# Altium project Receptor 32.PrjPcb
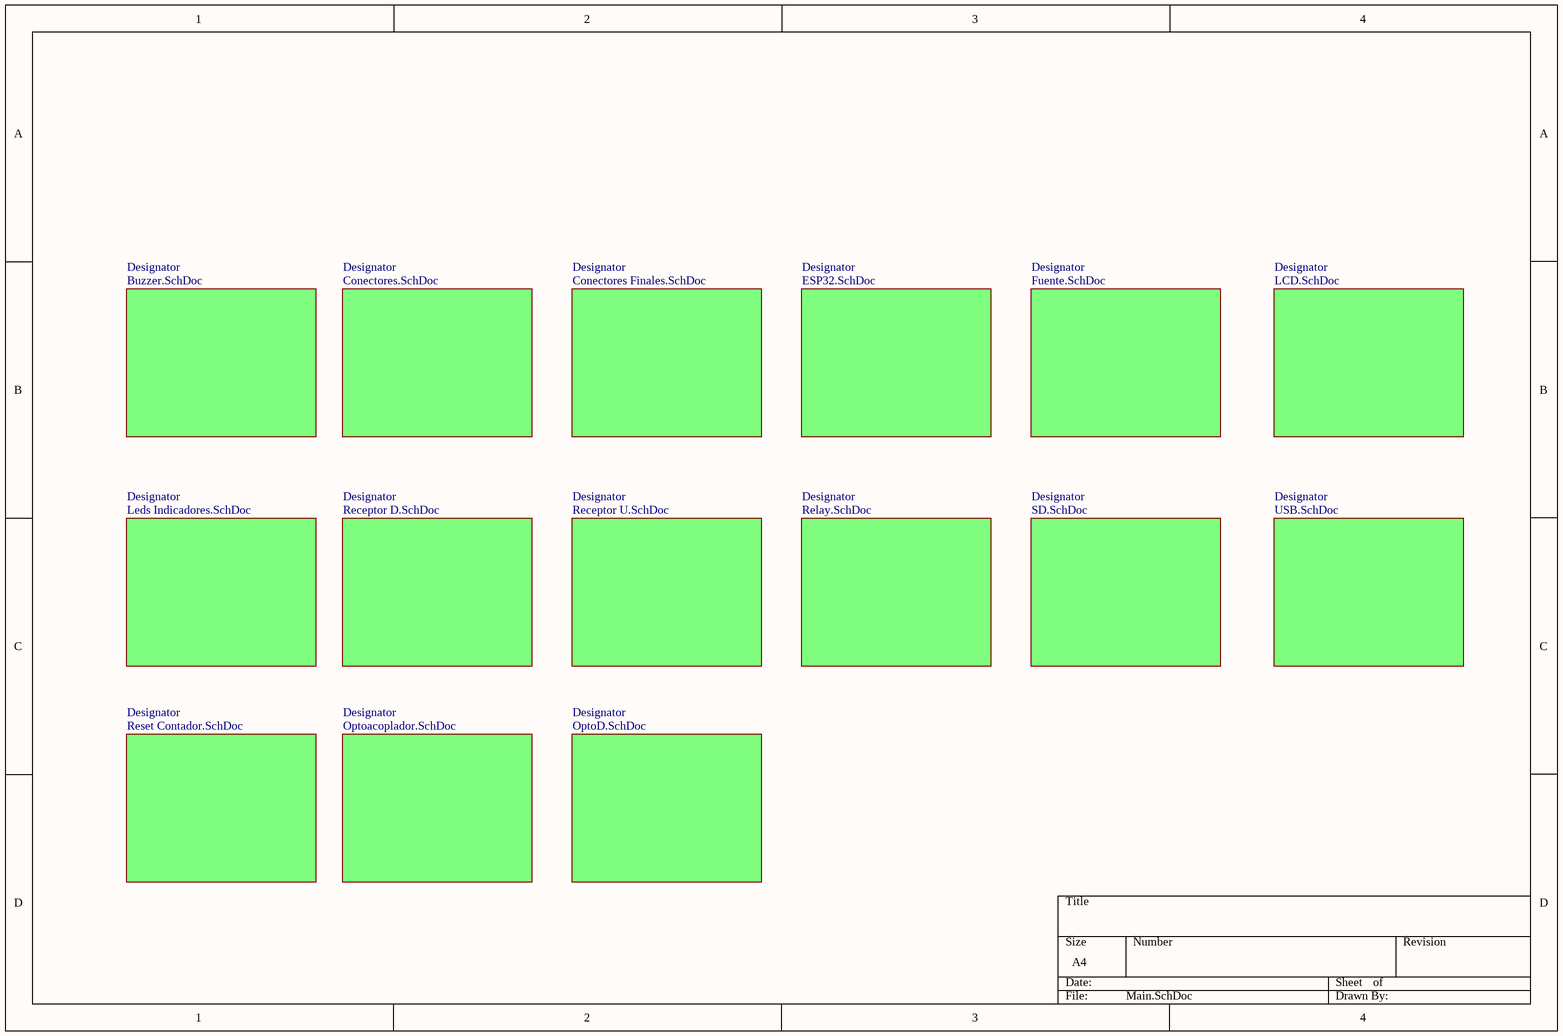
[diagram p0: Main.SchDoc]
16 sheets, 139 parts. Net scope: global (net labels, ports and power ports of the same name join across sheets).
Board files: Receptor32DV1.0.PcbDoc, Receptor32UV1.0.PcbDoc
Sheets:
  Main.SchDoc
    Designator = Buzzer.SchDoc
    Designator = Conectores.SchDoc
    Designator = Conectores Finales.SchDoc
    Designator = ESP32.SchDoc
    Designator = Fuente.SchDoc
    Designator = LCD.SchDoc
    Designator = Leds Indicadores.SchDoc
    Designator = Receptor D.SchDoc
    Designator = Receptor U.SchDoc
    Designator = Relay.SchDoc
    Designator = SD.SchDoc
    Designator = USB.SchDoc
    Designator = Reset Contador.SchDoc
    Designator = Optoacoplador.SchDoc
    Designator = OptoD.SchDoc

## Sheet Main.SchDoc
size A4

### Sub-sheets
Designator = Buzzer.SchDoc: no entries
Designator = Conectores.SchDoc: no entries
Designator = Conectores Finales.SchDoc: no entries
Designator = ESP32.SchDoc: no entries
Designator = Fuente.SchDoc: no entries
Designator = LCD.SchDoc: no entries
Designator = Leds Indicadores.SchDoc: no entries
Designator = Receptor D.SchDoc: no entries
Designator = Receptor U.SchDoc: no entries
Designator = Relay.SchDoc: no entries
Designator = SD.SchDoc: no entries
Designator = USB.SchDoc: no entries
Designator = Reset Contador.SchDoc: no entries
Designator = Optoacoplador.SchDoc: no entries
Designator = OptoD.SchDoc: no entries

## Sheet Buzzer.SchDoc
size A4
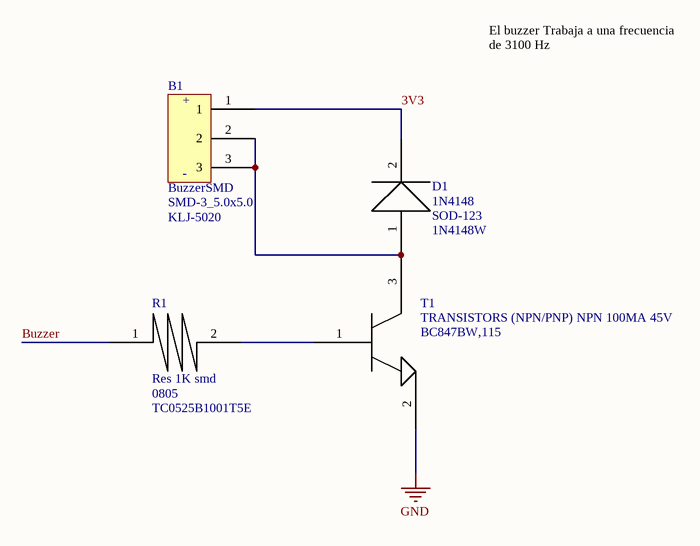
[diagram p1: Buzzer.SchDoc]

### Parts
B1  BuzzerSMD  Package: SMD-3_5.0x5.0  MFR.Part #: KLJ-5020  [BUZZERSMD]
D1  1N4148  Package: SOD-123  MFR.Part #: 1N4148W  [1N4148]
R1  Res 1K smd  Package: 0805  MFR.Part #: TC0525B1001T5E  [RES 1K]
T1  TRANSISTORS (NPN/PNP) NPN 100MA 45V  Supplier Number Part: BC847BW,115  [C8659]

### Nets
GND: T1.2
3V3: B1.1 D1.2
Buzzer: R1.1
NetB1_2: B1.2 B1.3 D1.1 T1.3
NetR1_2: R1.2 T1.1

### Notes on the sheet
- El buzzer Trabaja a una frecuencia de 3100 Hz
- (in symbol BuzzerSMD) +; -

### Library data of the parts
T1 = C8659: TRANSISTORS (NPN/PNP) NPN 100MA 45V SOT-323(SC-70) ROHS; Package Part: SOT-323-3

## Sheet Conectores.SchDoc
size A4
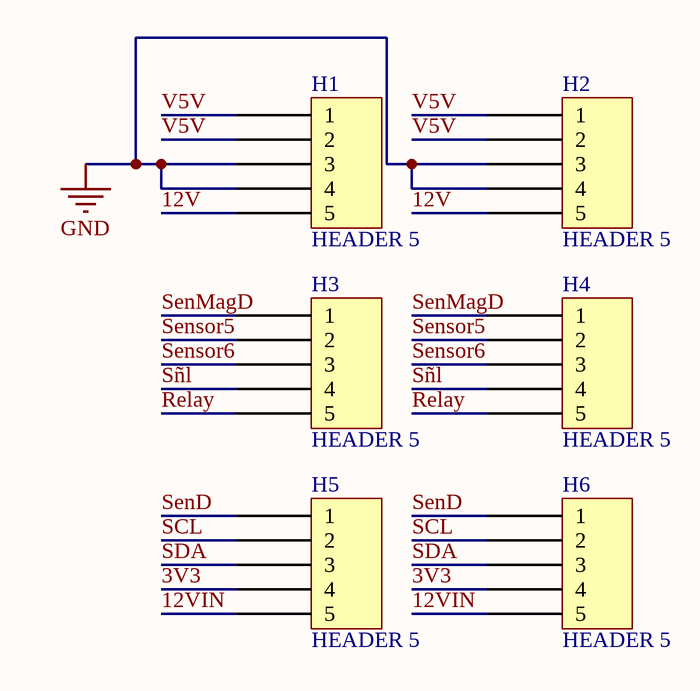
[diagram p2: Conectores.SchDoc]

### Parts
H1  HEADER 5  [HEADER5]
H2  HEADER 5  [HEADER5]
H3  HEADER 5  [HEADER5]
H4  HEADER 5  [HEADER5]
H5  HEADER 5  [HEADER5]
H6  HEADER 5  [HEADER5]

### Nets
GND: H1.3 H1.4 H2.3 H2.4
3V3: H5.4 H6.4
12V: H1.5 H2.5
12VIN: H5.5 H6.5
Relay: H3.5 H4.5
SCL: H5.2 H6.2
SDA: H5.3 H6.3
SenD: H5.1 H6.1
SenMagD: H3.1 H4.1
Sensor5: H3.2 H4.2
Sensor6: H3.3 H4.3
Sñl: H3.4 H4.4
V5V: H1.1 H1.2 H2.1 H2.2

## Sheet Conectores Finales.SchDoc
size A4
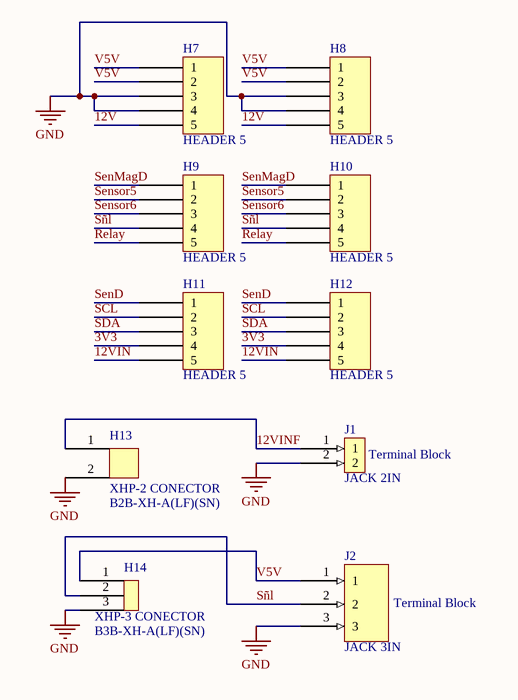
[diagram p3: Conectores Finales.SchDoc]

### Parts
H7  HEADER 5  [HEADER5]
H8  HEADER 5  [HEADER5]
H9  HEADER 5  [HEADER5]
H10  HEADER 5  [HEADER5]
H11  HEADER 5  [HEADER5]
H12  HEADER 5  [HEADER5]
H13  XHP-2 CONECTOR  [CONECTOR 2 PINES]
H14  XHP-3 CONECTOR  [CONECTOR XHP-3]
J1  JACK 2IN  [Terminal Blocks 2in]
J2  JACK 3IN  [Terminal Blocks 3in]

### Nets
GND: H7.3 H7.4 H8.3 H8.4 H13.2 H14.3 J1.2 J2.3
3V3: H11.4 H12.4
12V: H7.5 H8.5
12VIN: H11.5 H12.5
12VINF: H13.1 J1.1
Relay: H9.5 H10.5
SCL: H11.2 H12.2
SDA: H11.3 H12.3
SenD: H11.1 H12.1
SenMagD: H9.1 H10.1
Sensor5: H9.2 H10.2
Sensor6: H9.3 H10.3
Sñl: H9.4 H10.4 H14.2 J2.2
V5V: H7.1 H7.2 H8.1 H8.2 H14.1 J2.1

### Notes on the sheet
- (in symbol JACK 2IN) Terminal Block
- (in symbol JACK 3IN) Terminal Block

### Library data of the parts
H13 = B2B-XH-A(LF)(SN): CONECTOR JST-XH 2 PINES; SUPPLIER NUMBER PART: B2B-XH-A(LF)(SN)
H14 = B3B-XH-A(LF)(SN): CONECTOR JST-XH 3 PINES; SUPPLIER NUMBER PART: B3B-XH-A(LF)(SN)
J1 = JACK 2IN: Pluggable Terminal Blocks WR-TBL Mod312 5.08mm 2Pin Opn Hztl PCBHdr; Manufacturer: Wurth Electronics; Manufacturer Part Number: 691312510002; Current Rating: 20 A; Mounting Angle: Horizontal; Mounting Method: PCB; Number of Positions: 2 Position; Voltage Rating: 300 V; Supplier 1: Mouser; RoHS: RoHS Compliant; Category: Pluggable Terminal Blocks; Stock 1: 413; Pricing 1: 1=0.528, 10=0.499, 50=0.475, 100=0.453, 500=0.429, 1000=0.416 (AUD); Color: Green; Connection Method: -; Contact Plating: Tin; Housing Material: Polybutylene Terephthalate (PBT); Packaging: Bulk; Product: Headers; Series: WR-TBL; Termination Style: Through Hole; Brand: Wurth Electronics; Contact Material: Brass; Flammability Rating: UL 94 V-0; Pitch: 5.08 mm; Wire Gauge Range: -; Wire Orientation: Horizontal; RoHS - Mouser: Y; Minimum Order Quantity: 1; Reeling: False; ComponentLink1URL: http://www.mouser.com/ds/2/445/6913125100xx-537850.pdf; ComponentLink1Description: http://www.mouser.com/ds/2/445/6913125100xx-537850.pdf; Supplier Part Number 1: 710-691312510002
J2 = JACK 3IN: Pluggable Terminal Blocks WR-TBL Mod312 5.08mm 3Pin Opn Hztl PCBHdr; Manufacturer: Wurth Electronics; Manufacturer Part Number: 691312510003; Current Rating: 20 A; Mounting Angle: Horizontal; Mounting Method: PCB; Number of Positions: 3 Position; Voltage Rating: 300 V; Supplier 1: Mouser; RoHS: RoHS Compliant; Category: Pluggable Terminal Blocks; Stock 1: 425; Pricing 1: 1=0.784, 10=0.750, 50=0.714, 100=0.677, 500=0.630, 1000=0.624 (AUD); Color: Green; Connection Method: -; Contact Plating: Tin; Housing Material: Polybutylene Terephthalate (PBT); Packaging: Bulk; Product: Headers; Series: WR-TBL; Termination Style: Through Hole; Brand: Wurth Electronics; Contact Material: Brass; Flammability Rating: UL 94 V-0; Pitch: 5.08 mm; Wire Gauge Range: -; Wire Orientation: Horizontal; RoHS - Mouser: Y; Minimum Order Quantity: 1; Reeling: False; ComponentLink1URL: http://www.mouser.com/ds/2/445/6913125100xx-537850.pdf; ComponentLink1Description: http://www.mouser.com/ds/2/445/6913125100xx-537850.pdf; Supplier Part Number 1: 710-691312510003

## Sheet ESP32.SchDoc
size A4
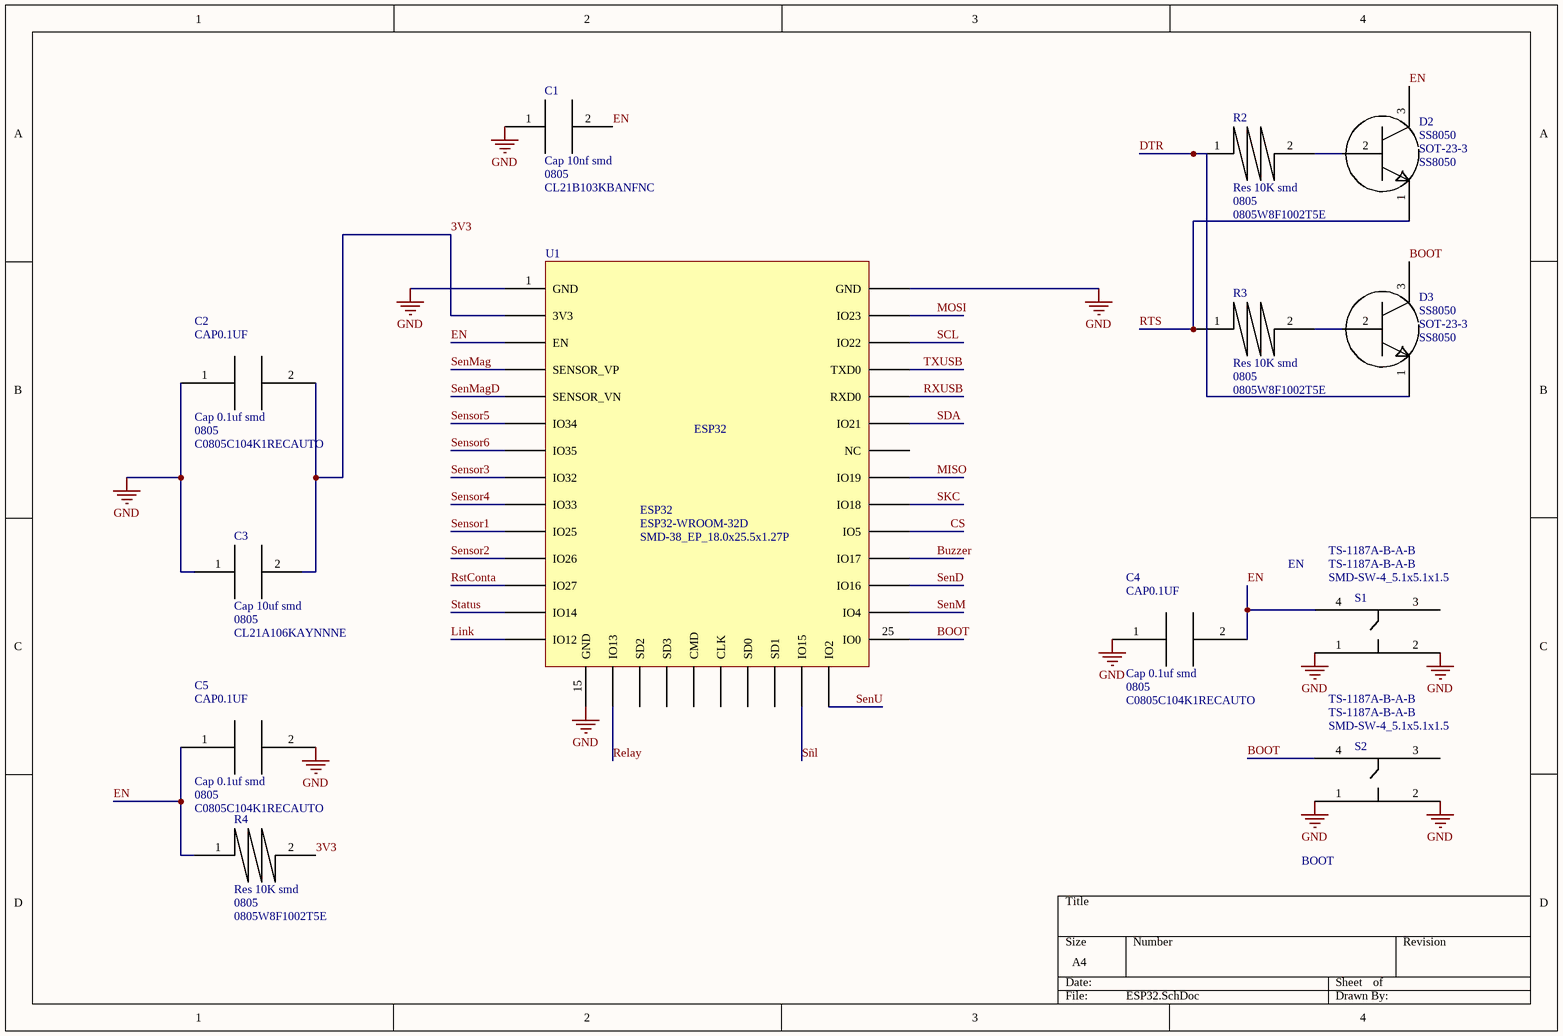
[diagram p4: ESP32.SchDoc]

### Parts
C1  Cap 10nf smd  Package: 0805  MFR.Part #: CL21B103KBANFNC  [CAP10NFSMD]
C2  Cap 0.1uf smd  Package: 0805  MFR.Part #: C0805C104K1RECAUTO  [CAP0.1UFSMD]
C3  Cap 10uf smd  Package: 0805  MFR.Part #: CL21A106KAYNNNE  [CAP10UFSMD]
C4  Cap 0.1uf smd  Package: 0805  MFR.Part #: C0805C104K1RECAUTO  [CAP0.1UFSMD]
C5  Cap 0.1uf smd  Package: 0805  MFR.Part #: C0805C104K1RECAUTO  [CAP0.1UFSMD]
D2  SS8050  Package: SOT-23-3  [SS8050]
D3  SS8050  Package: SOT-23-3  [SS8050]
R2  Res 10K smd  Package: 0805  MFR.Part #: 0805W8F1002T5E  [RES 10K]
R3  Res 10K smd  Package: 0805  MFR.Part #: 0805W8F1002T5E  [RES 10K]
R4  Res 10K smd  Package: 0805  MFR.Part #: 0805W8F1002T5E  [RES 10K]
S1  TS-1187A-B-A-B  Package: SMD-SW-4_5.1x5.1x1.5  [TS-1187A-B-A-B]
S2  TS-1187A-B-A-B  Package: SMD-SW-4_5.1x5.1x1.5  [TS-1187A-B-A-B]
U1  ESP32  Package: SMD-38_EP_18.0x25.5x1.27P  MFR.Part #: ESP32-WROOM-32D  [ESP32]

### Nets
GND: C1.1 C2.1 C3.1 C4.1 C5.2 S1.1 S1.2 S2.1 S2.2 U1.1(GND) U1.15(GND) U1.38(GND)
3V3: C2.2 C3.2 R4.2 U1.2(3V3)
BOOT: D3.3 S2.4 U1.25(IO0)
Buzzer: U1.28(IO17)
CS: U1.29(IO5)
DTR: D3.1 R2.1
EN: C1.2 C4.2 C5.1 D2.3 R4.1 S1.4 U1.3(EN)
Link: U1.14(IO12)
MISO: U1.31(IO19)
MOSI: U1.37(IO23)
Relay: U1.16(IO13)
RstConta: U1.12(IO27)
RTS: D2.1 R3.1
RXUSB: U1.34(RXD0)
SCL: U1.36(IO22)
SDA: U1.33(IO21)
SenD: U1.27(IO16)
SenM: U1.26(IO4)
SenMag: U1.4(SENSOR_VP)
SenMagD: U1.5(SENSOR_VN)
Sensor1: U1.10(IO25)
Sensor2: U1.11(IO26)
Sensor3: U1.8(IO32)
Sensor4: U1.9(IO33)
Sensor5: U1.6(IO34)
Sensor6: U1.7(IO35)
SenU: U1.24(IO2)
SKC: U1.30(IO18)
Status: U1.13(IO14)
Sñl: U1.23(IO15)
TXUSB: U1.35(TXD0)
NetD2_2: D2.2 R2.2
NetD3_2: D3.2 R3.2

Not connected (* = marked no-connect by the designer): S1 3; S2 3; U1 17(SD2) 18(SD3) 19(CMD) 20(CLK) 21(SD0) 22(SD1) 32(NC)

### Notes on the sheet
- EN
- BOOT
- (in symbol Cap 0.1uf smd) CAP0.1UF

### Library data of the parts
C1 = Cap 10nf smd: 10nf
C2 C4 C5 = Cap 0.1uf smd: 0.1uf
C3 = Cap 10uf smd: 10uf
R2-R4 = Res 10K smd: 10K
D2 D3 = SS8050: MFR.Part #: SS8050
S1 S2 = TS-1187A-B-A-B: MFR.Part #: TS-1187A-B-A-B

## Sheet Fuente.SchDoc
size A4
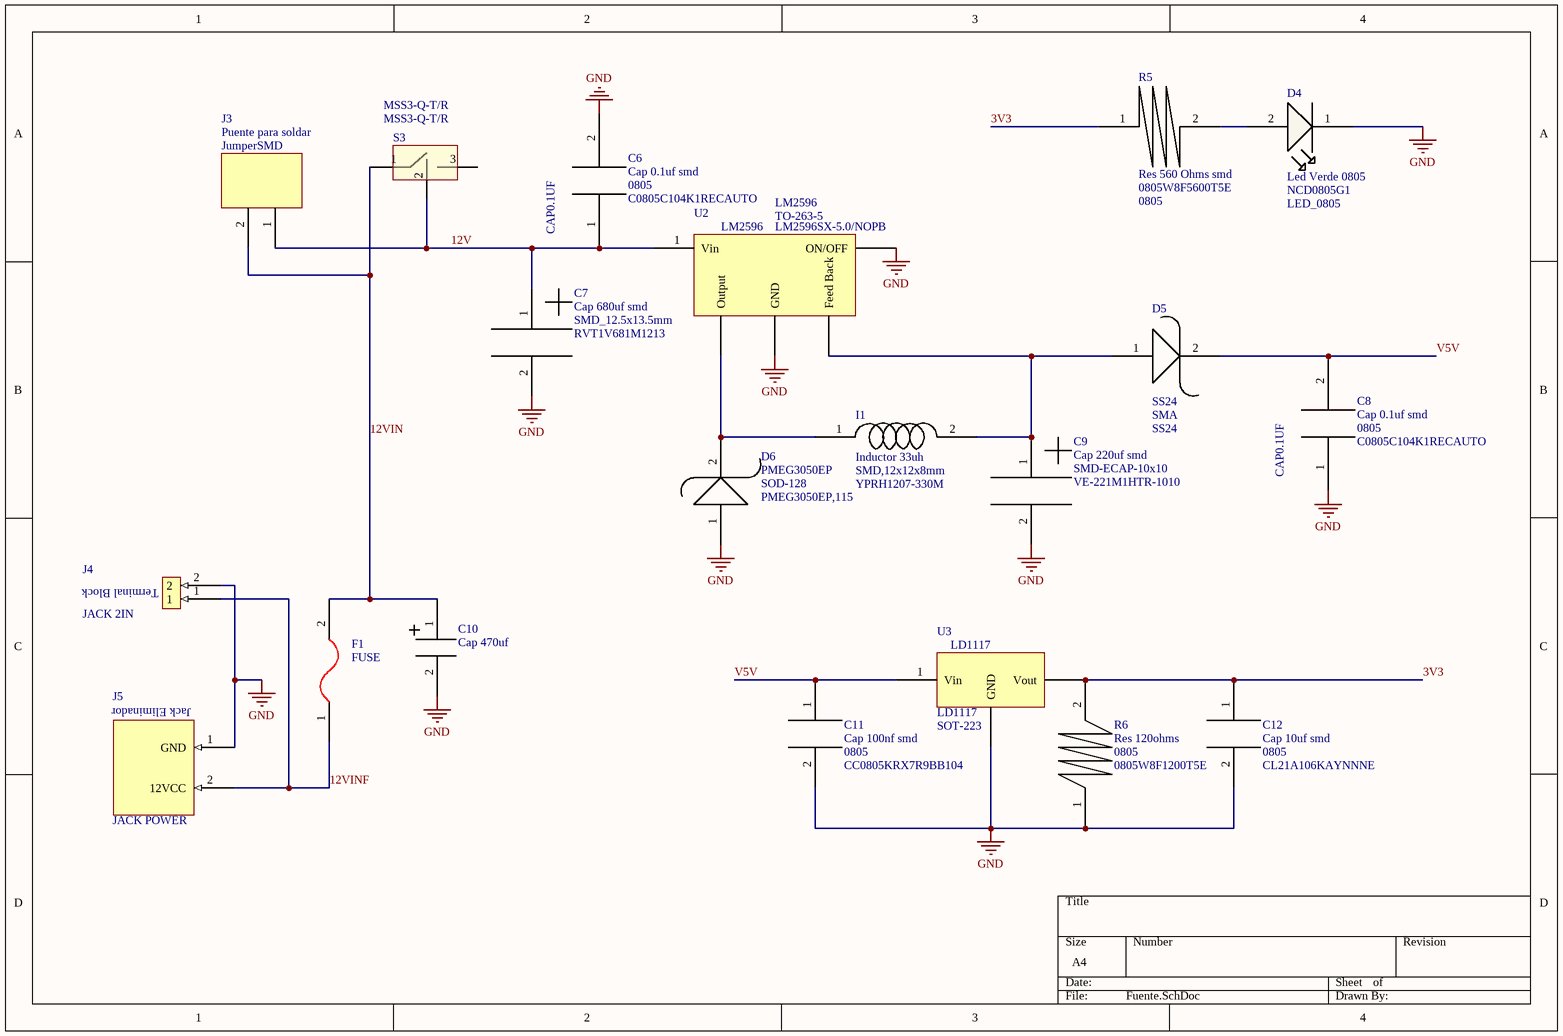
[diagram p5: Fuente.SchDoc]

### Parts
C6  Cap 0.1uf smd  Package: 0805  MFR.Part #: C0805C104K1RECAUTO  [CAP0.1UFSMD]
C7  Cap 680uf smd  Package: SMD_12.5x13.5mm  MFR.Part #: RVT1V681M1213  [CAP680UFSMD]
C8  Cap 0.1uf smd  Package: 0805  MFR.Part #: C0805C104K1RECAUTO  [CAP0.1UFSMD]
C9  Cap 220uf smd  Package: SMD-ECAP-10x10  MFR.Part #: VE-221M1HTR-1010  [CAP220UFSMD]
C10  Cap 470uf  [Cap 470uf]
C11  Cap 100nf smd  Package: 0805  MFR.Part #: CC0805KRX7R9BB104  [CAP100NFSMD]
C12  Cap 10uf smd  Package: 0805  MFR.Part #: CL21A106KAYNNNE  [CAP10UFSMD]
D4  Led Verde 0805  MFR.Part #: NCD0805G1  Package: LED_0805  [Led 0805 Verde]
D5  SS24  Package: SMA  [SS24]
D6  PMEG3050EP  Package: SOD-128  MFR.Part #: PMEG3050EP,115  [PMEG3050EP]
F1  FUSE  [FUSE]
I1  Inductor 33uh  Package: SMD,12x12x8mm  MFR.Part #: YPRH1207-330M  [Inductor 33UH]
J3  JumperSMD  [Jumper SMD]
J4  JACK 2IN  [Terminal Blocks 2in]
J5  JACK POWER  [POWER JACK]
R5  Res 560 Ohms smd  MFR.Part #: 0805W8F5600T5E  Package: 0805  [RES 560]
R6  Res 120ohms  Package: 0805  MFR.Part #: 0805W8F1200T5E  [RES 120OHMS]
S3  MSS3-Q-T/R  [MSS3-Q-T/R]
U2  LM2596  MFR.Part #: LM2596SX-5.0/NOPB  Package: TO-263-5  [LM2596]
U3  LD1117  Package: SOT-223  [LD1117]

### Nets
GND: C6.2 C7.2 C8.1 C9.2 C10.2 C11.2 C12.2 D4.1 D6.1 J4.2 J5.1(GND) J5.3(GND) R6.1 U2.3(GND) U2.5(ON/OFF) U3.2(GND)
3V3: C12.1 R5.1 R6.2 U3.3(Vout)
12V: C6.1 C7.1 J3.1 S3.2 U2.1(Vin)
12VIN: C10.1 F1.2 J3.2 S3.1
12VINF: F1.1 J4.1 J5.2(12VCC)
V5V: C8.2 C11.1 D5.2 U3.1(Vin)
NetC9_1: C9.1 D5.1 I1.2 U2.4(Feed_Back)
NetD4_2: D4.2 R5.2
NetD6_2: D6.2 I1.1 U2.2(Output)

Not connected (* = marked no-connect by the designer): S3 3

### Notes on the sheet
- (in symbol Cap 0.1uf smd) CAP0.1UF
- (in symbol JACK 2IN) Terminal Block
- (in symbol JACK 12V) Jack Eliminador
- (in symbol Jumper para soldar) Puente para soldar

### Library data of the parts
C6 C8 = Cap 0.1uf smd: 0.1uf
C7 = Cap 680uf smd: Cap 680uf
C9 = Cap 220uf smd: Cap 220uf
C10 = Cap 470uf: RVT1V471M1010; MFR.Part #: RVT1V471M1010; Package: SMD-ECAP-10x10
C11 = Cap 100nf smd: 100nf
C12 = Cap 10uf smd: 10uf
D4 = Led 0805 Verde
D5 = SS24: Schottky 40V 2A; MFR.Part #: SS24
D6 = PMEG3050EP: Diodo Schottky 30V 5A
F1 = FUSE HOLDER
I1 = Inductor 33uh: 33uh
J3 = Jumper para soldar
J4 = JACK 2IN: as J1 on sheet Conectores Finales; Supplier 1: Mouser; RoHS: RoHS Compliant; Category: Pluggable Terminal Blocks; Stock 1: 413; Pricing 1: 1=0.528, 10=0.499, 50=0.475, 100=0.453, 500=0.429, 1000=0.416 (AUD); Color: Green; Connection Method: -; Contact Plating: Tin; Housing Material: Polybutylene Terephthalate (PBT); Packaging: Bulk; Product: Headers; Series: WR-TBL; Termination Style: Through Hole; Brand: Wurth Electronics; Contact Material: Brass; Flammability Rating: UL 94 V-0; Pitch: 5.08 mm; Wire Gauge Range: -; Wire Orientation: Horizontal; RoHS - Mouser: Y; Minimum Order Quantity: 1; Reeling: False; ComponentLink1URL: http://www.mouser.com/ds/2/445/6913125100xx-537850.pdf; ComponentLink1Description: http://www.mouser.com/ds/2/445/6913125100xx-537850.pdf; Supplier Part Number 1: 710-691312510002
J5 = JACK 12V: DC Power Connectors R/A POWER JACK; Manufacturer: Switchcraft; Manufacturer Part Number: RAPC712X; Connector Type: DC Power Jack; Current Rating: 5 A; Inside Contact Diameter: 2.5 mm; Mounting Angle: Right; Insulation Resistance: 30 MOhms; Supplier 1: Mouser; RoHS: RoHS Compliant; Category: DC Power Connectors; Stock 1: 23988; Pricing 1: 1=1.52, 10=1.49, 25=1.44, 50=1.35, 100=1.26, 200=1.25, 500=1.19, 1000=1.10, 2000=1.06 (AUD); Color: Black; Contact Plating: Nickel; Housing Material: Thermoplastic; Packaging: Bulk; Product: Jacks; Series: RAPC; Termination Style: Through Hole; Brand: Switchcraft; Contact Material: Brass; Flammability Rating: UL 94 V-0; Contact Gender: Female; Product Category: DC Jacks; Standard Pack Qty: 2500; RoHS - Mouser: Y; Minimum Order Quantity: 1; Reeling: False; ComponentLink1URL: http://www.mouser.com/ds/2/393/rapc712x_cd-371318.pdf; ComponentLink1Description: http://www.mouser.com/ds/2/393/rapc712x_cd-371318.pdf; Supplier Part Number 1: 502-RAPC712X
R6 = Res 120ohms: 120 ohms
S3 = MSS3-Q-T/R: Package: SW-SMD; MFR.Part #: MSS3-Q-T/R

## Sheet LCD.SchDoc
size A4
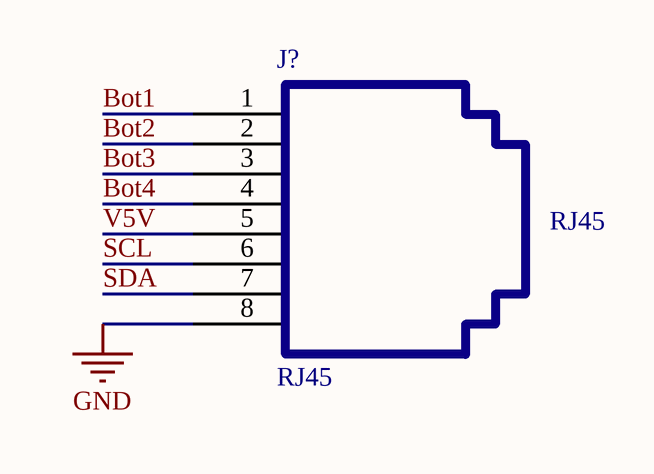
[diagram p6: LCD.SchDoc]

### Parts
J?  RJ45  [RJ45 PLUG]

### Nets
GND: J?.8 J?.9
Bot1: J?.1
Bot2: J?.2
Bot3: J?.3
Bot4: J?.4
SCL: J?.6
SDA: J?.7
V5V: J?.5

### Library data of the parts
J? = RJ45: Modular Connectors / Ethernet Connectors 8 PCB TOP ENTRY; Manufacturer: TE Connectivity / AMP; Manufacturer Part Number: 5556416-1; Mounting Angle: Vertical; Number of Positions: 8 Position; Shielding: Unshielded; Number of Ports: 1; Performance Category: Cat 3; Supplier 1: Mouser; RoHS: RoHS Compliant; Category: Modular Connectors / Ethernet Connectors; Stock 1: 28811; Pricing 1: 1=1.89, 25=1.79, 50=1.71, 100=1.63, 200=1.48, 500=1.33, 1000=1.18, 2000=1.07, 5000=1.04 (AUD); Color: Black; Contact Plating: Gold; Housing Material: Polybutylene Terephthalate (PBT); Packaging: Tray; Series: 555; Termination Style: Through Hole; Brand: TE Connectivity / AMP; Contact Material: Phosphor Bronze; Flammability Rating: UL 94 V-0; Product Category: Modular Jacks; Standard Pack Qty: 152; USOC Codes: RJ45; RoHS - Mouser: Y; Minimum Order Quantity: 1; Reeling: False; ComponentLink1URL: http://www.mouser.com/ds/2/418/NG_CD_5556416_C1-628847.pdf; ComponentLink1Description: http://www.mouser.com/ds/2/418/NG_CD_5556416_C1-628847.pdf; Supplier Part Number 1: 571-5556416-1

## Sheet Leds Indicadores.SchDoc
size A4
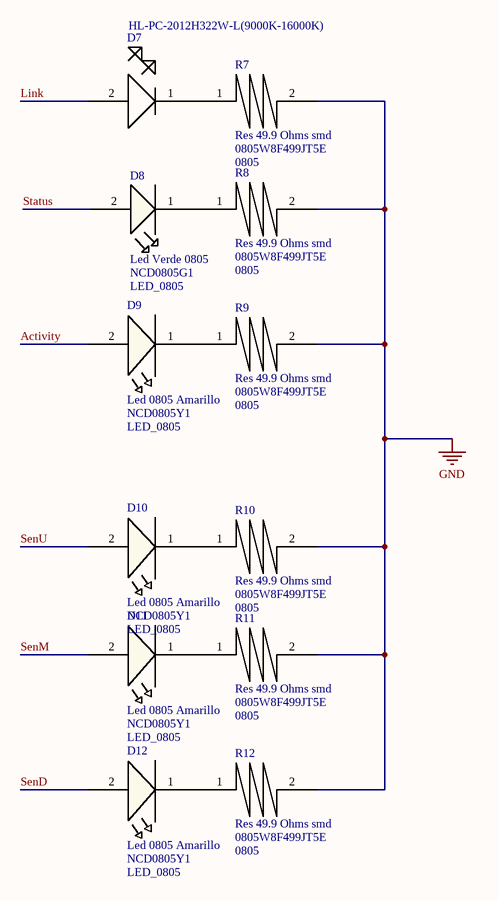
[diagram p7: Leds Indicadores.SchDoc]

### Parts
D7  HL-PC-2012H322W-L(9000K-16000K)  [Led 0805 White]
D8  Led Verde 0805  MFR.Part #: NCD0805G1  Package: LED_0805  [Led 0805 Verde]
D9  Led 0805 Amarillo  Package: LED_0805  [Led 0805 Amarillo]
D10  Led 0805 Amarillo  Package: LED_0805  [Led 0805 Amarillo]
D11  Led 0805 Amarillo  Package: LED_0805  [Led 0805 Amarillo]
D12  Led 0805 Amarillo  Package: LED_0805  [Led 0805 Amarillo]
R7  Res 49.9 Ohms smd  MFR.Part #: 0805W8F499JT5E  Package: 0805  [RES 49.9 OHMS]
R8  Res 49.9 Ohms smd  MFR.Part #: 0805W8F499JT5E  Package: 0805  [RES 49.9 OHMS]
R9  Res 49.9 Ohms smd  MFR.Part #: 0805W8F499JT5E  Package: 0805  [RES 49.9 OHMS]
R10  Res 49.9 Ohms smd  MFR.Part #: 0805W8F499JT5E  Package: 0805  [RES 49.9 OHMS]
R11  Res 49.9 Ohms smd  MFR.Part #: 0805W8F499JT5E  Package: 0805  [RES 49.9 OHMS]
R12  Res 49.9 Ohms smd  MFR.Part #: 0805W8F499JT5E  Package: 0805  [RES 49.9 OHMS]

### Nets
GND: R7.2 R8.2 R9.2 R10.2 R11.2 R12.2
Activity: D9.2
Link: D7.2
SenD: D12.2
SenM: D11.2
SenU: D10.2
Status: D8.2
NetD7_1: D7.1 R7.1
NetD8_1: D8.1 R8.1
NetD9_1: D9.1 R9.1
NetD10_1: D10.1 R10.1
NetD11_1: D11.1 R11.1
NetD12_1: D12.1 R12.1

### Library data of the parts
D7 = LED White 0805: MFR.Part #: HL-PC-2012H322W-L(9000K-16000K); Package: LED0805-RD
D8 = Led 0805 Verde
D9-D12 = Led 0805 Amarillo: NCD0805Y1; MFR.Part #: NCD0805Y1

## Sheet Receptor D.SchDoc
size A4
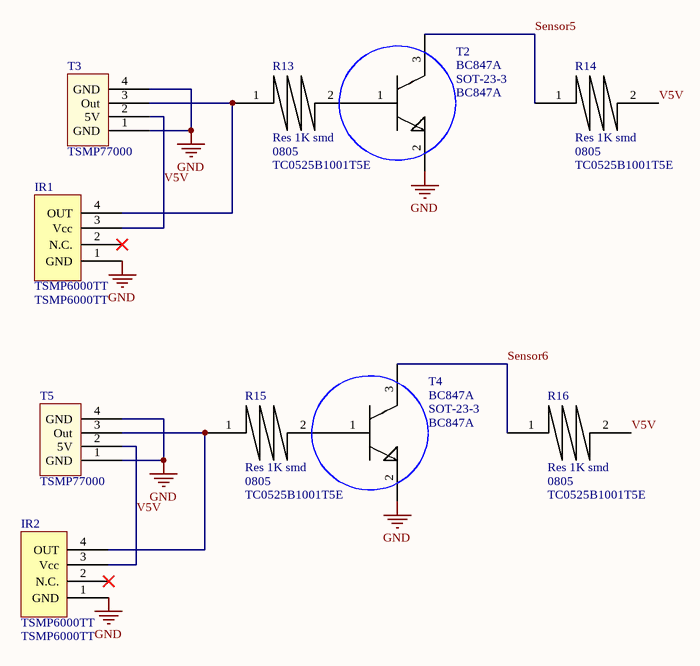
[diagram p8: Receptor D.SchDoc]

### Parts
IR1  TSMP6000TT  [TSMP6000TT]
IR2  TSMP6000TT  [TSMP6000TT]
R13  Res 1K smd  Package: 0805  MFR.Part #: TC0525B1001T5E  [RES 1K]
R14  Res 1K smd  Package: 0805  MFR.Part #: TC0525B1001T5E  [RES 1K]
R15  Res 1K smd  Package: 0805  MFR.Part #: TC0525B1001T5E  [RES 1K]
R16  Res 1K smd  Package: 0805  MFR.Part #: TC0525B1001T5E  [RES 1K]
T2  BC847A  Package: SOT-23-3  [BC847A]
T3  TSMP77000  [TSMP77000]
T4  BC847A  Package: SOT-23-3  [BC847A]
T5  TSMP77000  [TSMP77000]

### Nets
GND: IR1.1(GND) IR2.1(GND) T2.2 T3.1(GND) T3.4(GND) T4.2 T5.1(GND) T5.4(GND)
Sensor5: R14.1 T2.3
Sensor6: R16.1 T4.3
V5V: IR1.3(Vcc) IR2.3(Vcc) R14.2 R16.2 T3.2(5V) T5.2(5V)
NetIR1_4: IR1.4(OUT) R13.1 T3.3(Out)
NetIR2_4: IR2.4(OUT) R15.1 T5.3(Out)
NetR13_2: R13.2 T2.1
NetR15_2: R15.2 T4.1

Not connected (* = marked no-connect by the designer): IR1 2(N.C.)*; IR2 2(N.C.)*

### Library data of the parts
IR1 IR2 = TSMP6000TT: Mouser: https://www.mouser.mx/ProductDetail/Vishay-Semiconductors/TSMP6000TT?qs=N%2FGwOzoYEAATz68ZRXkk4Q%3D%3D; DGK: https://www.digikey.com.mx/es/products/detail/vishay-semiconductor-opto-division/TSMP6000TT/4696166; Part: TSMP6000TT
T2 T4 = BC847A: MFR.Part #: BC847A
T3 T5 = TSMP77000: # Parte: TSMP77000; Link: https://www.mouser.mx/datasheet/2/427/VISH_S_A0012397601_1-2572564.pdf

## Sheet Receptor U.SchDoc
size A4
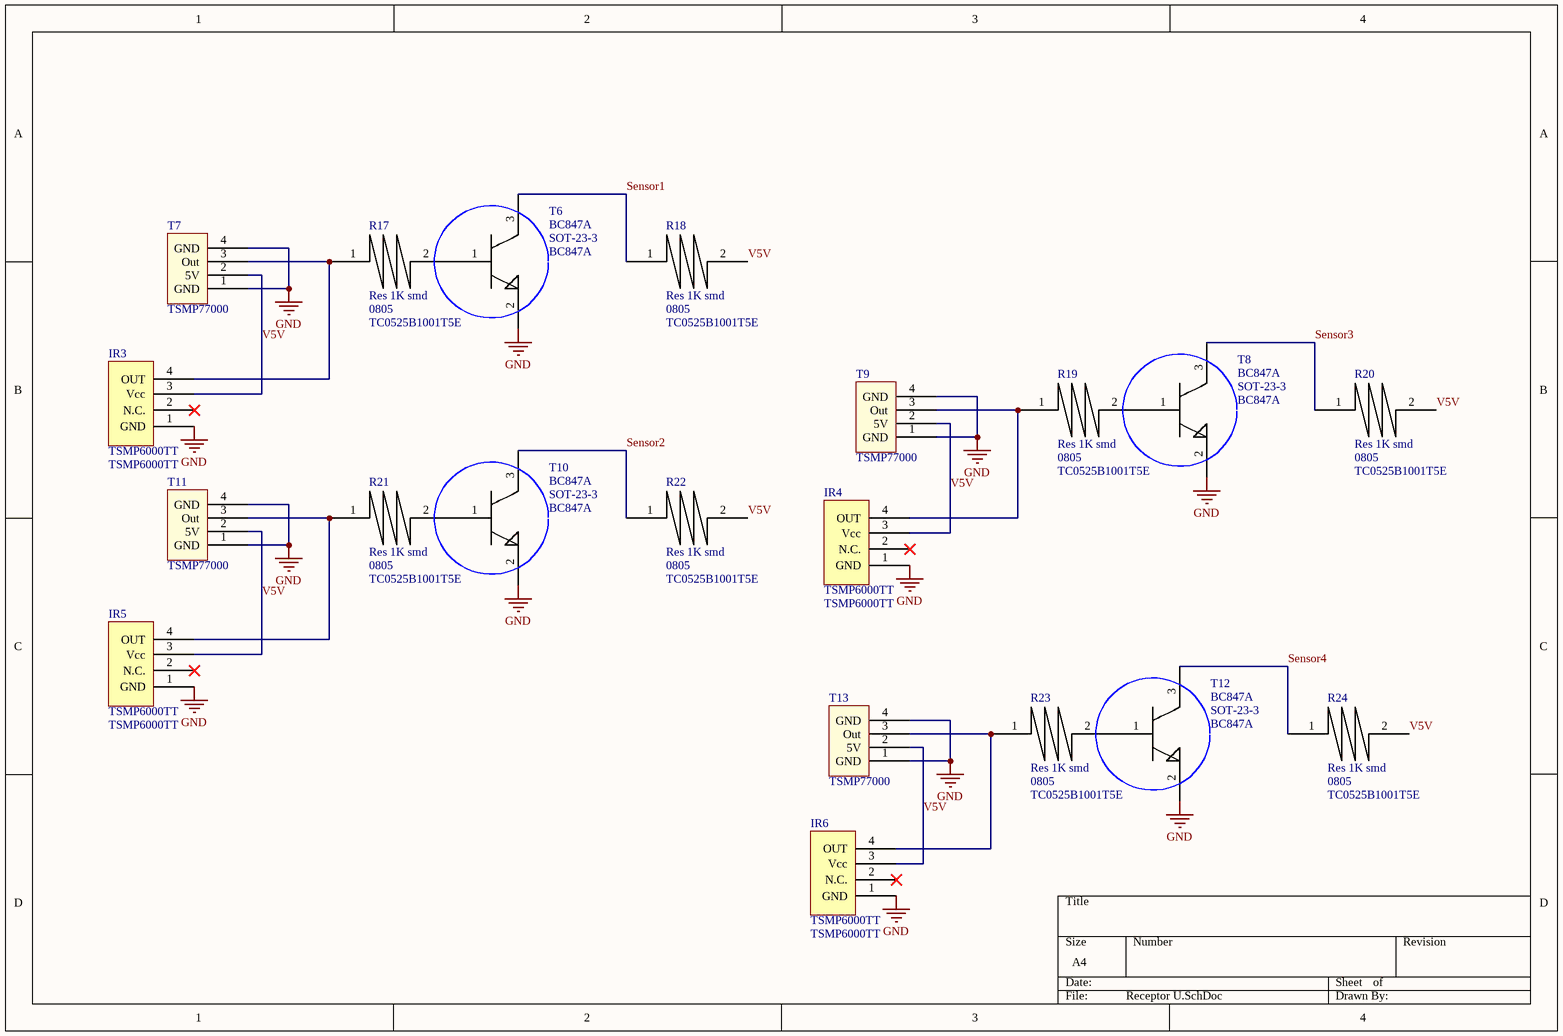
[diagram p9: Receptor U.SchDoc]

### Parts
IR3  TSMP6000TT  [TSMP6000TT]
IR4  TSMP6000TT  [TSMP6000TT]
IR5  TSMP6000TT  [TSMP6000TT]
IR6  TSMP6000TT  [TSMP6000TT]
R17  Res 1K smd  Package: 0805  MFR.Part #: TC0525B1001T5E  [RES 1K]
R18  Res 1K smd  Package: 0805  MFR.Part #: TC0525B1001T5E  [RES 1K]
R19  Res 1K smd  Package: 0805  MFR.Part #: TC0525B1001T5E  [RES 1K]
R20  Res 1K smd  Package: 0805  MFR.Part #: TC0525B1001T5E  [RES 1K]
R21  Res 1K smd  Package: 0805  MFR.Part #: TC0525B1001T5E  [RES 1K]
R22  Res 1K smd  Package: 0805  MFR.Part #: TC0525B1001T5E  [RES 1K]
R23  Res 1K smd  Package: 0805  MFR.Part #: TC0525B1001T5E  [RES 1K]
R24  Res 1K smd  Package: 0805  MFR.Part #: TC0525B1001T5E  [RES 1K]
T6  BC847A  Package: SOT-23-3  [BC847A]
T7  TSMP77000  [TSMP77000]
T8  BC847A  Package: SOT-23-3  [BC847A]
T9  TSMP77000  [TSMP77000]
T10  BC847A  Package: SOT-23-3  [BC847A]
T11  TSMP77000  [TSMP77000]
T12  BC847A  Package: SOT-23-3  [BC847A]
T13  TSMP77000  [TSMP77000]

### Nets
GND: IR3.1(GND) IR4.1(GND) IR5.1(GND) IR6.1(GND) T6.2 T7.1(GND) T7.4(GND) T8.2 T9.1(GND) T9.4(GND) T10.2 T11.1(GND) T11.4(GND) T12.2 T13.1(GND) T13.4(GND)
Sensor1: R18.1 T6.3
Sensor2: R22.1 T10.3
Sensor3: R20.1 T8.3
Sensor4: R24.1 T12.3
V5V: IR3.3(Vcc) IR4.3(Vcc) IR5.3(Vcc) IR6.3(Vcc) R18.2 R20.2 R22.2 R24.2 T7.2(5V) T9.2(5V) T11.2(5V) T13.2(5V)
NetIR3_4: IR3.4(OUT) R17.1 T7.3(Out)
NetIR4_4: IR4.4(OUT) R19.1 T9.3(Out)
NetIR5_4: IR5.4(OUT) R21.1 T11.3(Out)
NetIR6_4: IR6.4(OUT) R23.1 T13.3(Out)
NetR17_2: R17.2 T6.1
NetR19_2: R19.2 T8.1
NetR21_2: R21.2 T10.1
NetR23_2: R23.2 T12.1

Not connected (* = marked no-connect by the designer): IR3 2(N.C.)*; IR4 2(N.C.)*; IR5 2(N.C.)*; IR6 2(N.C.)*

### Library data of the parts
IR3-IR6 = TSMP6000TT: Mouser: https://www.mouser.mx/ProductDetail/Vishay-Semiconductors/TSMP6000TT?qs=N%2FGwOzoYEAATz68ZRXkk4Q%3D%3D; DGK: https://www.digikey.com.mx/es/products/detail/vishay-semiconductor-opto-division/TSMP6000TT/4696166; Part: TSMP6000TT
T6 T8 T10 T12 = BC847A: MFR.Part #: BC847A
T7 T9 T11 T13 = TSMP77000: # Parte: TSMP77000; Link: https://www.mouser.mx/datasheet/2/427/VISH_S_A0012397601_1-2572564.pdf

## Sheet Relay.SchDoc
size A4
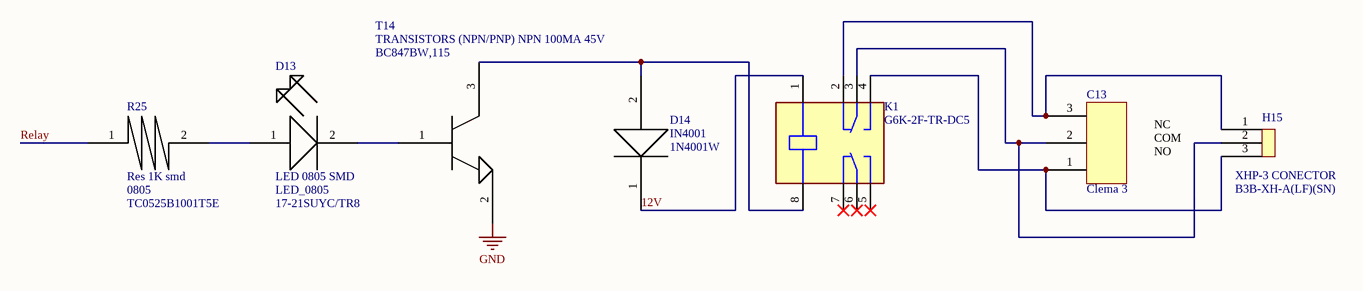
[diagram p10: Relay.SchDoc]

### Parts
C13  Clema 3  [Clema3]
D13  LED 0805 SMD  Package: LED_0805  MFR.Part #: 17-21SUYC/TR8  [LED SMD Amarillo]
D14  IN4001  Supplier Number Part: 1N4001W  [C162732]
H15  XHP-3 CONECTOR  [CONECTOR XHP-3]
K1  G6K-2F-TR-DC5  [RELAY_G6K-2F-TR-DC5]
R25  Res 1K smd  Package: 0805  MFR.Part #: TC0525B1001T5E  [RES 1K]
T14  TRANSISTORS (NPN/PNP) NPN 100MA 45V  Supplier Number Part: BC847BW,115  [C8659]

### Nets
GND: T14.2
12V: D14.1 K1.1
Relay: R25.1
NetC13_1: C13.1 H15.3 K1.4
NetC13_2: C13.2 H15.2 K1.3
NetC13_3: C13.3 H15.1 K1.2
NetD13_1: D13.1 R25.2
NetD13_2: D13.2 T14.1
NetD14_2: D14.2 K1.8 T14.3

Not connected (* = marked no-connect by the designer): K1 5* 6* 7*

### Notes on the sheet
- NC
  COM
  NO

### Library data of the parts
C13 = Clema3
D13 = LED 0805 SMD: LED 0805 Yellow
D14 = C162732: DIODES - GENERAL PURPOSE 50V 1A 1.1V @ 1A SOD-123F ROHS; Package Part: SOD-123
H15 = B3B-XH-A(LF)(SN): CONECTOR JST-XH 3 PINES; SUPPLIER NUMBER PART: B3B-XH-A(LF)(SN)
K1 = G6K-2F-TR-DC5: Telecom Relay DPDT (2 Form C) Surface Mount; MF: Omron Electronics; Availability: Warning; Check_prices: https://www.snapeda.com/parts/G6K-2F-TR-DC5/Omron%20Electronics%20Inc-EMC%20Div/view-part/2886130/?ref=eda; Value: *; Package: None; MP: G6K-2F-TR-DC5; Price: None; Purchase-URL: https://pricing.snapeda.com/search/part/G6K-2F-TR-DC5/?ref=eda; SnapEDA_Link: https://www.snapeda.com/parts/G6K-2F-TR-DC5/Omron%20Electronics%20Inc-EMC%20Div/view-part/2886130/?ref=snap
T14 = C8659: as T1 on sheet Buzzer

## Sheet SD.SchDoc
size A4
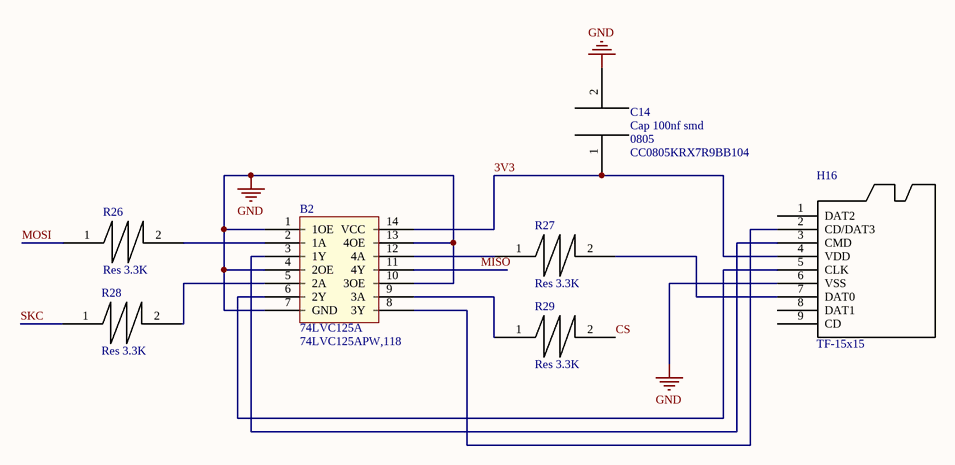
[diagram p11: SD.SchDoc]

### Parts
B2  74LVC125A  [74LVC125APW,118]
C14  Cap 100nf smd  Package: 0805  MFR.Part #: CC0805KRX7R9BB104  [CAP100NFSMD]
H16  TF-15x15  [TF-15x15]
R26  Res 3.3K  [Res 3.3K]
R27  Res 3.3K  [Res 3.3K]
R28  Res 3.3K  [Res 3.3K]
R29  Res 3.3K  [Res 3.3K]

### Nets
GND: B2.1(1OE) B2.4(2OE) B2.7(GND) B2.10(3OE) B2.13(4OE) C14.2 H16.6(VSS)
3V3: B2.14(VCC) C14.1 H16.4(VDD)
CS: R29.2
MISO: B2.11(4Y)
MOSI: R26.1
SKC: R28.1
NetB2_2: B2.2(1A) R26.2
NetB2_3: B2.3(1Y) H16.3(CMD)
NetB2_5: B2.5(2A) R28.2
NetB2_6: B2.6(2Y) H16.5(CLK)
NetB2_8: B2.8(3Y) H16.2(CD/DAT3)
NetB2_9: B2.9(3A) R29.1
NetB2_12: B2.12(4A) R27.1
NetH16_7: H16.7(DAT0) R27.2

Not connected (* = marked no-connect by the designer): H16 1(DAT2) 8(DAT1) 9(CD)

### Library data of the parts
C14 = Cap 100nf smd: 100nf
R26-R29 = Res 3.3K: AECR0805F3K30K9; MFR.Part #: AECR0805F3K30K9; Package: 0805
B2 = 74LVC125A: Package: TSSOP-14_4.4x5.0x0.65P; MFR.Part #: 74LVC125APW,118
H16 = TF-15x15: MFR.Part #: TF-15x15; Package: 14.5x14.75x1.85mm

## Sheet USB.SchDoc
size A4
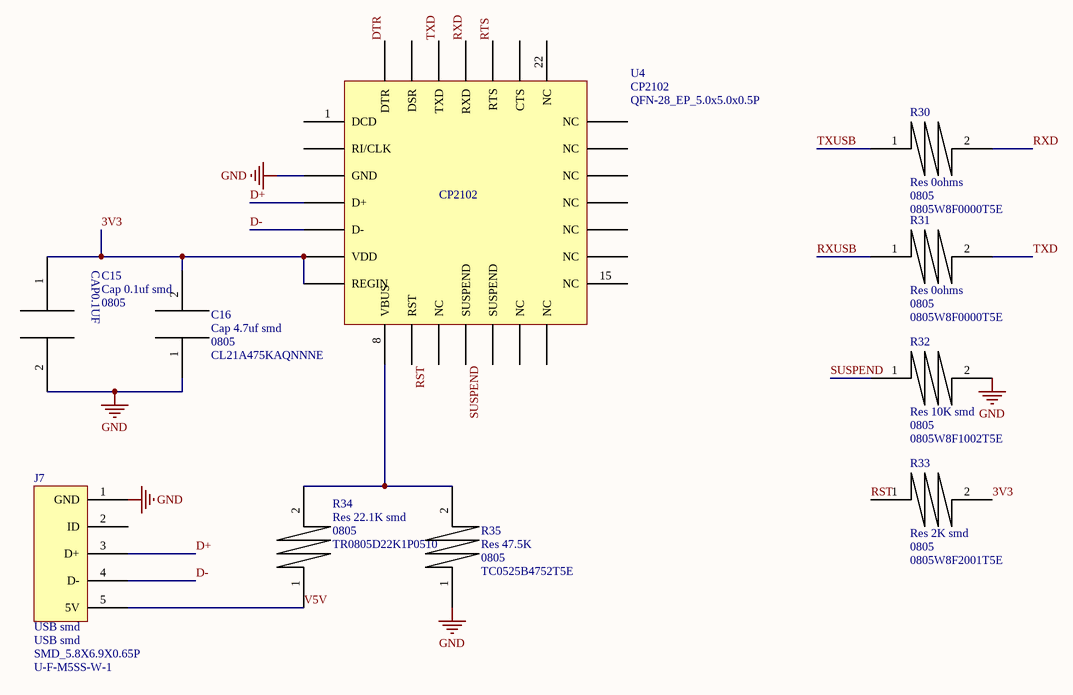
[diagram p12: USB.SchDoc]

### Parts
C15  Cap 0.1uf smd  Package: 0805  [CAP0.1UFSMD]
C16  Cap 4.7uf smd  Package: 0805  MFR.Part #: CL21A475KAQNNNE  [CAP4.7UFSMD]
J7  USB smd  Package: SMD_5.8X6.9X0.65P  MFR.Part #: U-F-M5SS-W-1  [USB smd]
R30  Res 0ohms  Package: 0805  MFR.Part #: 0805W8F0000T5E  [RES 0 Ohms]
R31  Res 0ohms  Package: 0805  MFR.Part #: 0805W8F0000T5E  [RES 0 Ohms]
R32  Res 10K smd  Package: 0805  MFR.Part #: 0805W8F1002T5E  [RES 10K]
R33  Res 2K smd  Package: 0805  MFR.Part #: 0805W8F2001T5E  [RES 2K]
R34  Res 22.1K smd  Package: 0805  MFR.Part #: TR0805D22K1P0510  [RES 22.1K]
R35  Res 47.5K  Package: 0805  MFR.Part #: TC0525B4752T5E  [RES 47.5K]
U4  CP2102  Package: QFN-28_EP_5.0x5.0x0.5P  [CP2102]

### Nets
GND: C15.2 C16.1 J7.1(GND) R32.2 R35.1 U4.3(GND)
3V3: C15.1 C16.2 R33.2 U4.6(VDD) U4.7(REGIN)
D+: J7.3(D+) U4.4(D+)
D-: J7.4(D-) U4.5(D-)
DTR: U4.28(DTR)
RST: R33.1 U4.9(RST)
RTS: U4.24(RTS)
RXD: R30.2 U4.25(RXD)
RXUSB: R31.1
SUSPEND: R32.1 U4.11(SUSPEND)
TXD: R31.2 U4.26(TXD)
TXUSB: R30.1
V5V: J7.5(5V) R34.1
NetR34_2: R34.2 R35.2 U4.8(VBUS)

Not connected (* = marked no-connect by the designer): J7 2(ID); U4 1(DCD) 2(RI/CLK) 10(NC) 12(SUSPEND) 13(NC) 14(NC) 15(NC) 16(NC) 17(NC) 18(NC) 19(NC) 20(NC) 21(NC) 22(NC) 23(CTS) 27(DSR)

### Notes on the sheet
- (in symbol Cap 0.1uf smd) CAP0.1UF

### Library data of the parts
C15 = Cap 0.1uf smd: 0.1uf
C16 = Cap 4.7uf smd: 4.7uf
R32 = Res 10K smd: 10K
R33 = Res 2K smd: 2K
R34 = Res 22.1K smd: 22.1K
R35 = Res 47.5K: 47.5K

## Sheet Reset Contador.SchDoc
size A4
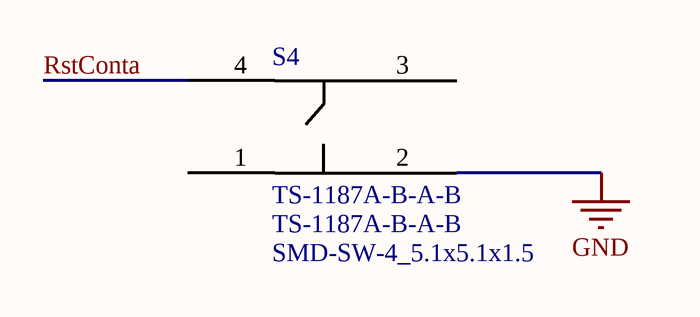
[diagram p13: Reset Contador.SchDoc]

### Parts
S4  TS-1187A-B-A-B  Package: SMD-SW-4_5.1x5.1x1.5  [TS-1187A-B-A-B]

### Nets
GND: S4.2
RstConta: S4.4

Not connected (* = marked no-connect by the designer): S4 1 3

### Library data of the parts
S4 = TS-1187A-B-A-B: MFR.Part #: TS-1187A-B-A-B

## Sheet Optoacoplador.SchDoc
size A4
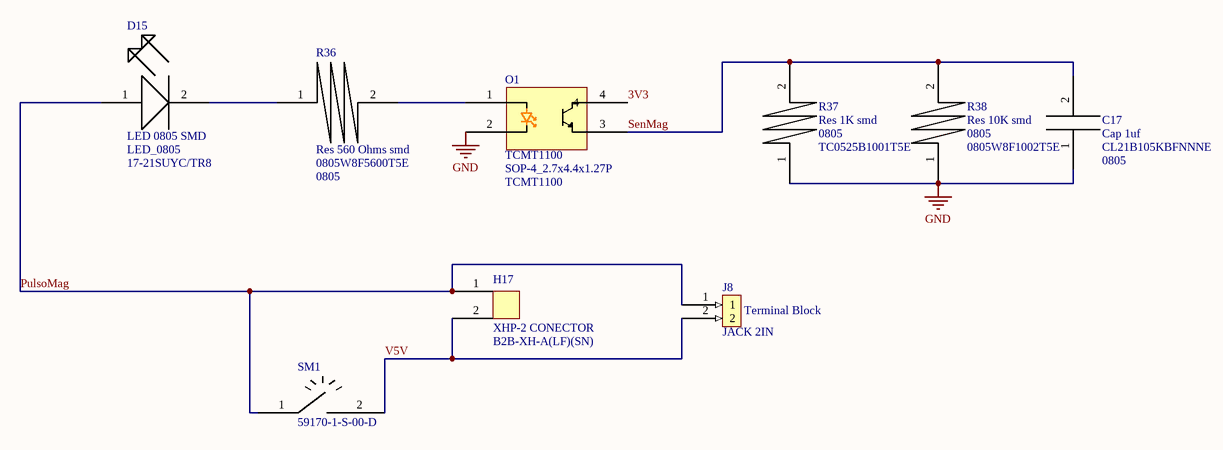
[diagram p14: Optoacoplador.SchDoc]

### Parts
C17  Cap 1uf  MFR.Part #: CL21B105KBFNNNE  Package: 0805  [CAP 1UFSMD]
D15  LED 0805 SMD  Package: LED_0805  MFR.Part #: 17-21SUYC/TR8  [LED SMD Amarillo]
H17  XHP-2 CONECTOR  [CONECTOR 2 PINES]
J8  JACK 2IN  [Terminal Blocks 2in]
O1  TCMT1100  Package: SOP-4_2.7x4.4x1.27P  [TCMT110]
R36  Res 560 Ohms smd  MFR.Part #: 0805W8F5600T5E  Package: 0805  [RES 560]
R37  Res 1K smd  Package: 0805  MFR.Part #: TC0525B1001T5E  [RES 1K]
R38  Res 10K smd  Package: 0805  MFR.Part #: 0805W8F1002T5E  [RES 10K]
SM1  59170-1-S-00-D  [Switch Magnetico]

### Nets
GND: C17.1 O1.2 R37.1 R38.1
3V3: O1.4
PulsoMag: D15.1 H17.1 J8.1 SM1.1
SenMag: C17.2 O1.3 R37.2 R38.2
V5V: H17.2 J8.2 SM1.2
NetD15_2: D15.2 R36.1
NetO1_1: O1.1 R36.2

### Notes on the sheet
- (in symbol JACK 2IN) Terminal Block

### Library data of the parts
D15 = LED 0805 SMD: LED 0805 Yellow
H17 = B2B-XH-A(LF)(SN): CONECTOR JST-XH 2 PINES; SUPPLIER NUMBER PART: B2B-XH-A(LF)(SN)
J8 = JACK 2IN: as J1 on sheet Conectores Finales; Supplier 1: Mouser; RoHS: RoHS Compliant; Category: Pluggable Terminal Blocks; Stock 1: 413; Pricing 1: 1=0.528, 10=0.499, 50=0.475, 100=0.453, 500=0.429, 1000=0.416 (AUD); Color: Green; Connection Method: -; Contact Plating: Tin; Housing Material: Polybutylene Terephthalate (PBT); Packaging: Bulk; Product: Headers; Series: WR-TBL; Termination Style: Through Hole; Brand: Wurth Electronics; Contact Material: Brass; Flammability Rating: UL 94 V-0; Pitch: 5.08 mm; Wire Gauge Range: -; Wire Orientation: Horizontal; RoHS - Mouser: Y; Minimum Order Quantity: 1; Reeling: False; ComponentLink1URL: http://www.mouser.com/ds/2/445/6913125100xx-537850.pdf; ComponentLink1Description: http://www.mouser.com/ds/2/445/6913125100xx-537850.pdf; Supplier Part Number 1: 710-691312510002
O1 = TCMT110: MFR.Part #: TCMT1100
R38 = Res 10K smd: 10K
SM1 = 59170-1-S-00-D: MFR.Part #: 59170-1-S-00-D; Package: SENSOR-SMD

## Sheet OptoD.SchDoc
size A4
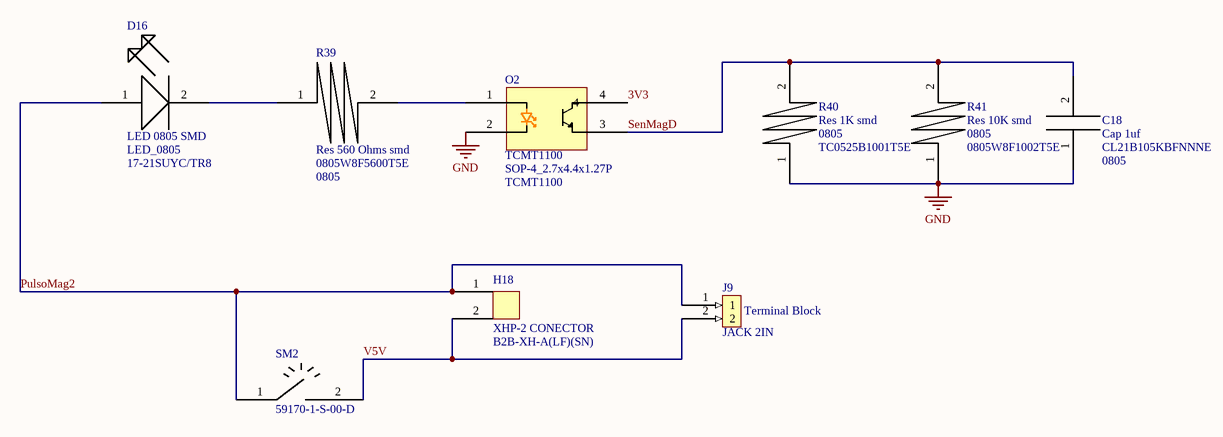
[diagram p15: OptoD.SchDoc]

### Parts
C18  Cap 1uf  MFR.Part #: CL21B105KBFNNNE  Package: 0805  [CAP 1UFSMD]
D16  LED 0805 SMD  Package: LED_0805  MFR.Part #: 17-21SUYC/TR8  [LED SMD Amarillo]
H18  XHP-2 CONECTOR  [CONECTOR 2 PINES]
J9  JACK 2IN  [Terminal Blocks 2in]
O2  TCMT1100  Package: SOP-4_2.7x4.4x1.27P  [TCMT110]
R39  Res 560 Ohms smd  MFR.Part #: 0805W8F5600T5E  Package: 0805  [RES 560]
R40  Res 1K smd  Package: 0805  MFR.Part #: TC0525B1001T5E  [RES 1K]
R41  Res 10K smd  Package: 0805  MFR.Part #: 0805W8F1002T5E  [RES 10K]
SM2  59170-1-S-00-D  [Switch Magnetico]

### Nets
GND: C18.1 O2.2 R40.1 R41.1
3V3: O2.4
PulsoMag2: D16.1 H18.1 J9.1 SM2.1
SenMagD: C18.2 O2.3 R40.2 R41.2
V5V: H18.2 J9.2 SM2.2
NetD16_2: D16.2 R39.1
NetO2_1: O2.1 R39.2

### Notes on the sheet
- (in symbol JACK 2IN) Terminal Block

### Library data of the parts
D16 = LED 0805 SMD: LED 0805 Yellow
H18 = B2B-XH-A(LF)(SN): CONECTOR JST-XH 2 PINES; SUPPLIER NUMBER PART: B2B-XH-A(LF)(SN)
J9 = JACK 2IN: as J1 on sheet Conectores Finales; Supplier 1: Mouser; RoHS: RoHS Compliant; Category: Pluggable Terminal Blocks; Stock 1: 413; Pricing 1: 1=0.528, 10=0.499, 50=0.475, 100=0.453, 500=0.429, 1000=0.416 (AUD); Color: Green; Connection Method: -; Contact Plating: Tin; Housing Material: Polybutylene Terephthalate (PBT); Packaging: Bulk; Product: Headers; Series: WR-TBL; Termination Style: Through Hole; Brand: Wurth Electronics; Contact Material: Brass; Flammability Rating: UL 94 V-0; Pitch: 5.08 mm; Wire Gauge Range: -; Wire Orientation: Horizontal; RoHS - Mouser: Y; Minimum Order Quantity: 1; Reeling: False; ComponentLink1URL: http://www.mouser.com/ds/2/445/6913125100xx-537850.pdf; ComponentLink1Description: http://www.mouser.com/ds/2/445/6913125100xx-537850.pdf; Supplier Part Number 1: 710-691312510002
O2 = TCMT110: MFR.Part #: TCMT1100
R41 = Res 10K smd: 10K
SM2 = 59170-1-S-00-D: MFR.Part #: 59170-1-S-00-D; Package: SENSOR-SMD

## Nets that join several sheets
GND: Buzzer (T1.2), Conectores (H1.3 H1.4 H2.3 H2.4), Conectores Finales (8 pins), ESP32 (12 pins), Fuente (16 pins), LCD (J?.8 J?.9), Leds Indicadores (6 pins), Receptor D (8 pins), Receptor U (16 pins), Relay (T14.2), SD (7 pins), USB (6 pins), Reset Contador (S4.2), Optoacoplador (C17.1 O1.2 R37.1 R38.1), OptoD (C18.1 O2.2 R40.1 R41.1)
3V3: Buzzer (B1.1 D1.2), Conectores (H5.4 H6.4), Conectores Finales (H11.4 H12.4), ESP32 (C2.2 C3.2 R4.2 U1.2), Fuente (C12.1 R5.1 R6.2 U3.3), SD (B2.14 C14.1 H16.4), USB (5 pins), Optoacoplador (O1.4), OptoD (O2.4)
12V: Conectores (H1.5 H2.5), Conectores Finales (H7.5 H8.5), Fuente (5 pins), Relay (D14.1 K1.1)
12VIN: Conectores (H5.5 H6.5), Conectores Finales (H11.5 H12.5), Fuente (C10.1 F1.2 J3.2 S3.1)
12VINF: Conectores Finales (H13.1 J1.1), Fuente (F1.1 J4.1 J5.2)
Buzzer: Buzzer (R1.1), ESP32 (U1.28)
CS: ESP32 (U1.29), SD (R29.2)
DTR: ESP32 (D3.1 R2.1), USB (U4.28)
Link: ESP32 (U1.14), Leds Indicadores (D7.2)
MISO: ESP32 (U1.31), SD (B2.11)
MOSI: ESP32 (U1.37), SD (R26.1)
Relay: Conectores (H3.5 H4.5), Conectores Finales (H9.5 H10.5), ESP32 (U1.16), Relay (R25.1)
RstConta: ESP32 (U1.12), Reset Contador (S4.4)
RTS: ESP32 (D2.1 R3.1), USB (U4.24)
RXUSB: ESP32 (U1.34), USB (R31.1)
SCL: Conectores (H5.2 H6.2), Conectores Finales (H11.2 H12.2), ESP32 (U1.36), LCD (J?.6)
SDA: Conectores (H5.3 H6.3), Conectores Finales (H11.3 H12.3), ESP32 (U1.33), LCD (J?.7)
SenD: Conectores (H5.1 H6.1), Conectores Finales (H11.1 H12.1), ESP32 (U1.27), Leds Indicadores (D12.2)
SenM: ESP32 (U1.26), Leds Indicadores (D11.2)
SenMag: ESP32 (U1.4), Optoacoplador (C17.2 O1.3 R37.2 R38.2)
SenMagD: Conectores (H3.1 H4.1), Conectores Finales (H9.1 H10.1), ESP32 (U1.5), OptoD (C18.2 O2.3 R40.2 R41.2)
Sensor1: ESP32 (U1.10), Receptor U (R18.1 T6.3)
Sensor2: ESP32 (U1.11), Receptor U (R22.1 T10.3)
Sensor3: ESP32 (U1.8), Receptor U (R20.1 T8.3)
Sensor4: ESP32 (U1.9), Receptor U (R24.1 T12.3)
Sensor5: Conectores (H3.2 H4.2), Conectores Finales (H9.2 H10.2), ESP32 (U1.6), Receptor D (R14.1 T2.3)
Sensor6: Conectores (H3.3 H4.3), Conectores Finales (H9.3 H10.3), ESP32 (U1.7), Receptor D (R16.1 T4.3)
SenU: ESP32 (U1.24), Leds Indicadores (D10.2)
SKC: ESP32 (U1.30), SD (R28.1)
Status: ESP32 (U1.13), Leds Indicadores (D8.2)
Sñl: Conectores (H3.4 H4.4), Conectores Finales (H9.4 H10.4 H14.2 J2.2), ESP32 (U1.23)
TXUSB: ESP32 (U1.35), USB (R30.1)
V5V: Conectores (H1.1 H1.2 H2.1 H2.2), Conectores Finales (6 pins), Fuente (C8.2 C11.1 D5.2 U3.1), LCD (J?.5), Receptor D (6 pins), Receptor U (12 pins), USB (J7.5 R34.1), Optoacoplador (H17.2 J8.2 SM1.2), OptoD (H18.2 J9.2 SM2.2)